# EasyEDA schematic ShutterController.json
TITLE: Shutter Controller; REV: 1.0; Date: 2021-11-27; Sheet: 1/1; Drawn By: M.P.M.; Company: MaPeMa
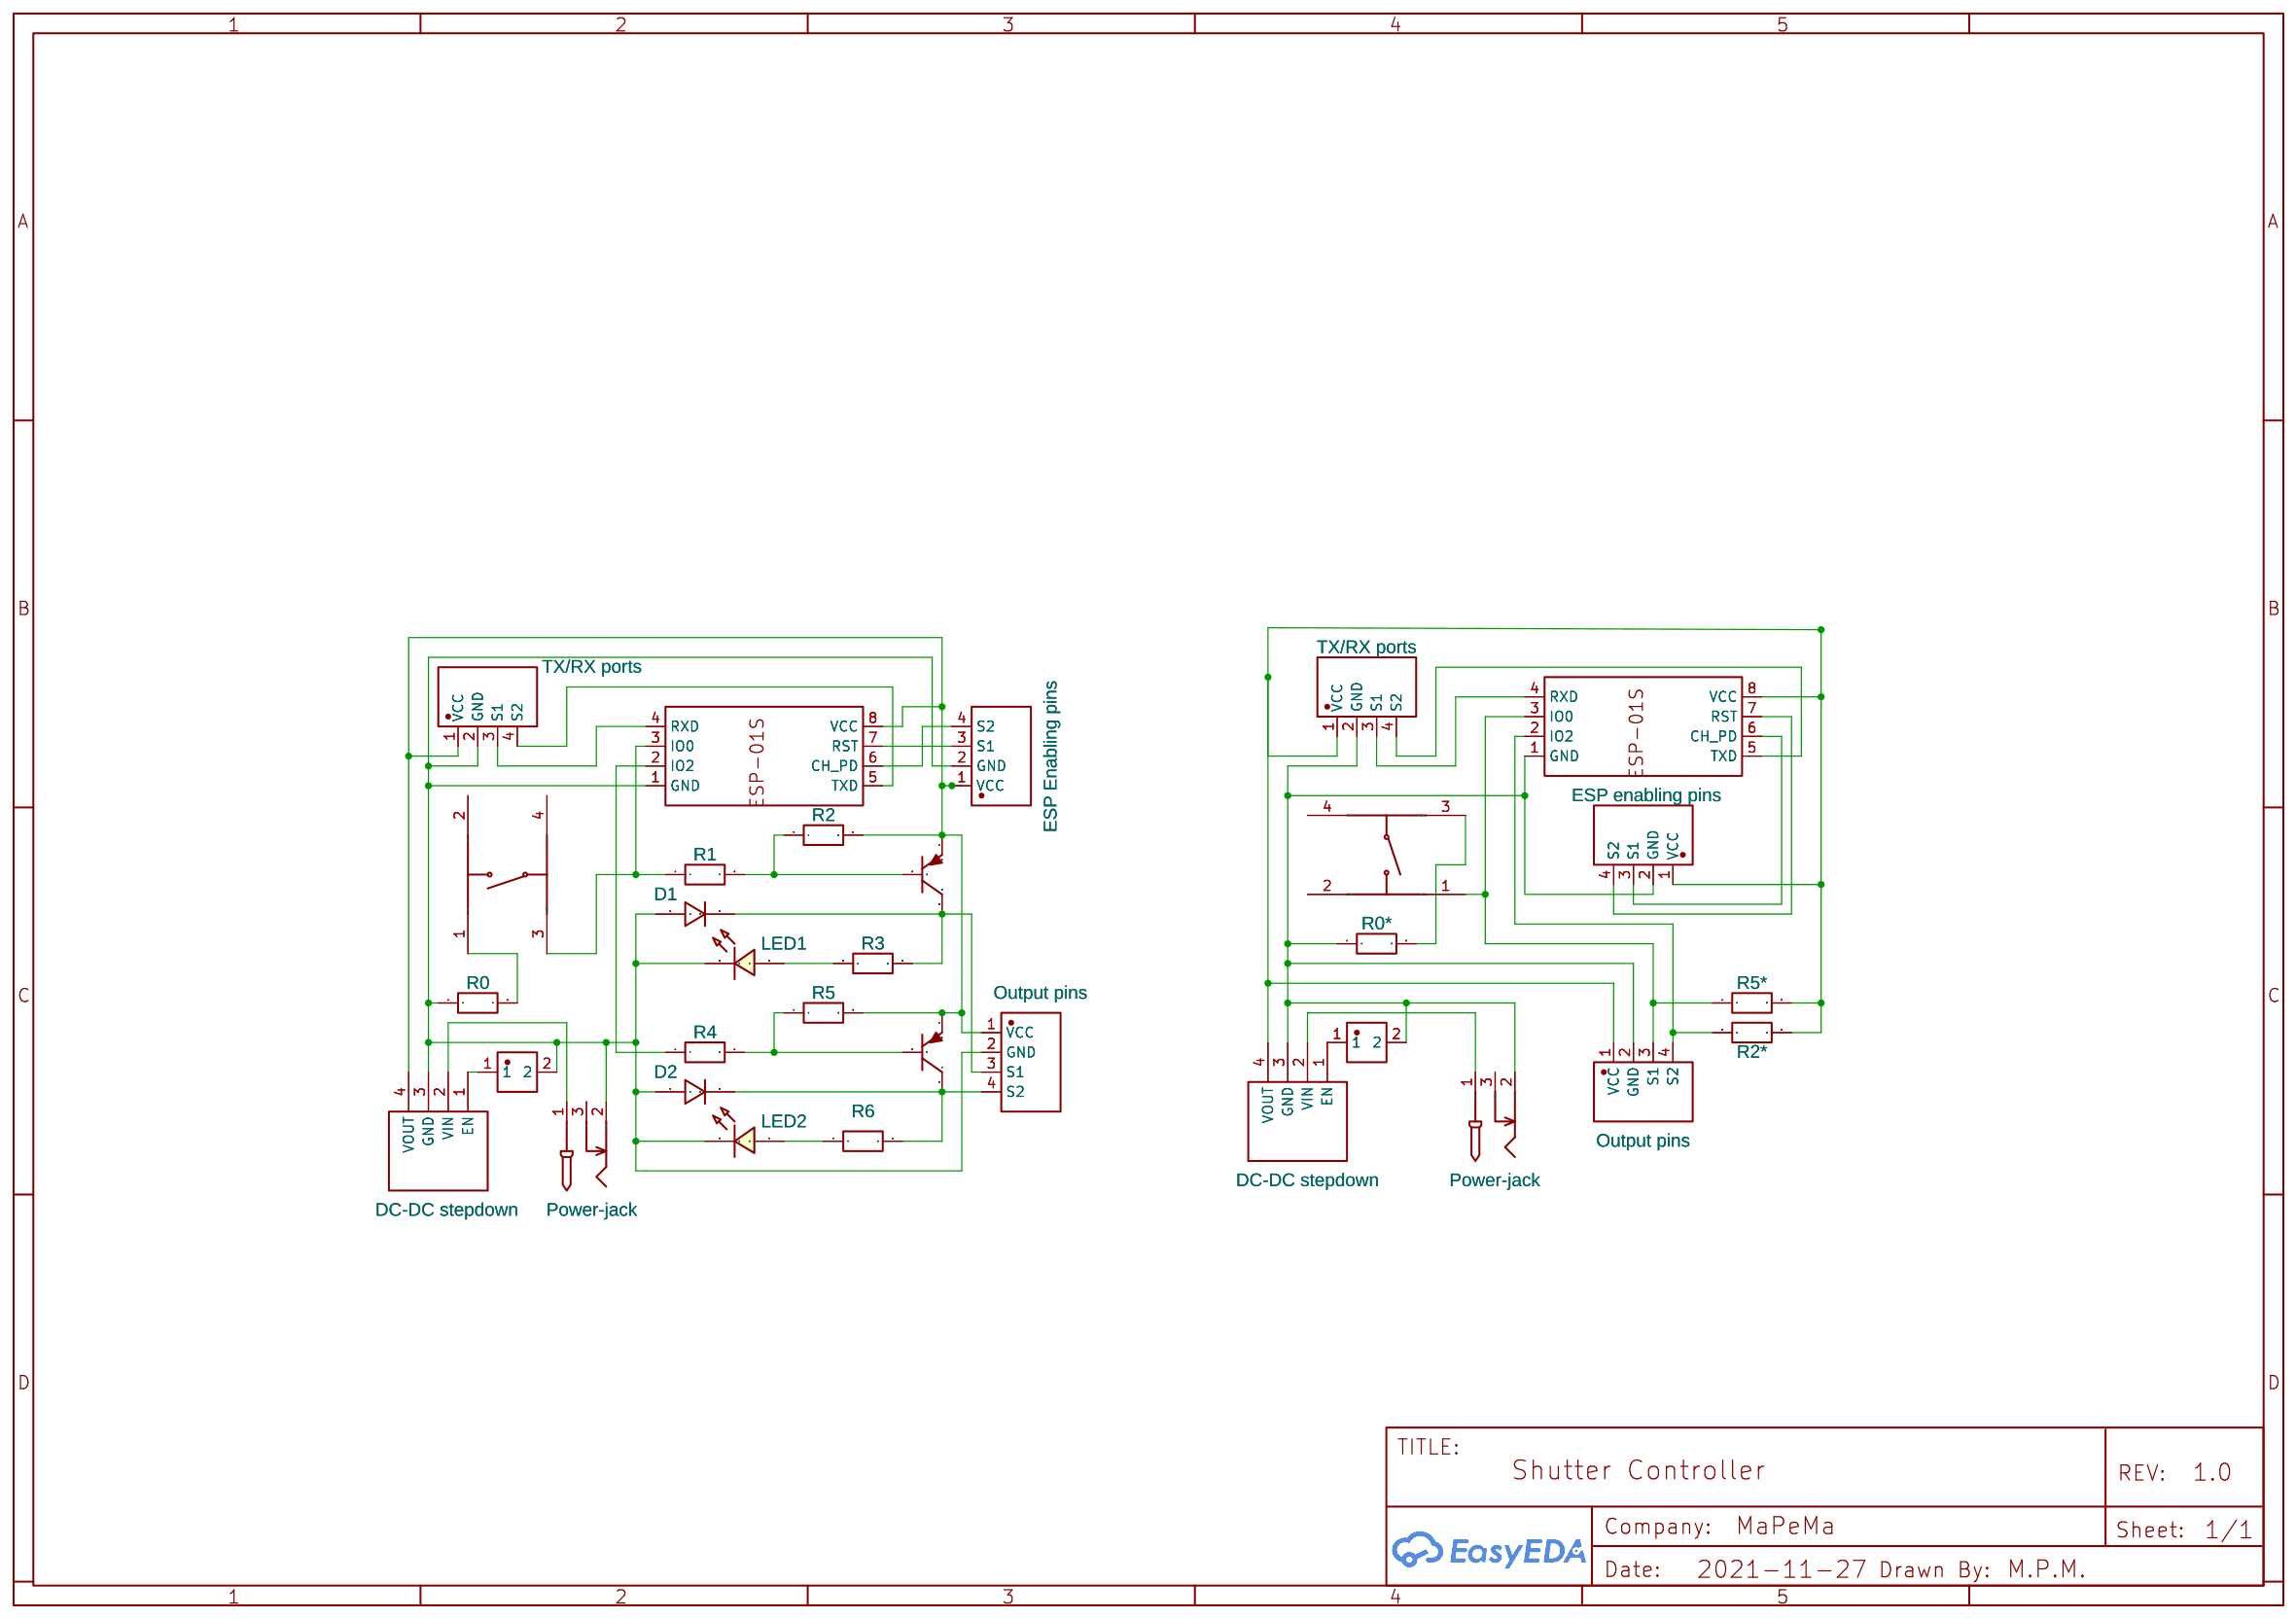
[diagram p0: schematic sheet]

## Parts
D1  1N4007  [DO-41_BD2.4-L4.7-P8.70-D0.9-RD]
D2  1N4007  [DO-41_BD2.4-L4.7-P8.70-D0.9-RD]
LED1  LED-TH-3mm_R  [LED-TH_BD3.0_RED]
LED2  LED-TH-3mm_R  [LED-TH_BD3.0_RED]
P1  Power-jack  [DC005-2.5MM]
P2  Power-jack  [DC005-2.5MM]
Q1  Bipolar PNP-SIL 2.54mm  [BIPOLAR TRANSISTOR-SIL 2.54 MM]
Q3  Bipolar PNP-SIL 2.54mm  [BIPOLAR TRANSISTOR-SIL 2.54 MM]
R0  1k  [R_AXIAL-0.3]
R0*  1k  [R_AXIAL-0.3]
R1  1k  [R_AXIAL-0.3]
R2  10k  [R_AXIAL-0.3]
R2*  1k  [R_AXIAL-0.3]
R3  1k  [R_AXIAL-0.3]
R4  1k  [R_AXIAL-0.3]
R5  10k  [R_AXIAL-0.3]
R5*  1k  [R_AXIAL-0.3]
R6  1k  [R_AXIAL-0.3]
SW1  Tactile_Switch_12*12*7.3 4 3 2 1  [TACTS-24N-F_12*12*7.3]
SW2  Tactile_Switch_12*12*7.3 4 3 2 1  [TACTS-24N-F_12*12*7.3]
U1  DC-DC stepdown  [STDN-3A24-ADJ]
U2  ESP-01S  [ESP-01S]
U3  TX/RX ports  [SIMPLE 4PIN CONNECTOR]
U4  Output pins  [SIMPLE 4PIN CONNECTOR]
U5  TX/RX ports  [SIMPLE 4PIN CONNECTOR]
U6  Simple 2pin connector  [SIMPLE 2PIN CONNECTOR]
U7  ESP Enabling pins  [SIMPLE 4PIN CONNECTOR]
U8  DC-DC stepdown  [STDN-3A24-ADJ]
U9  ESP-01S  [ESP-01S]
U10  ESP enabling pins  [SIMPLE 4PIN CONNECTOR]
U11  Output pins  [SIMPLE 4PIN CONNECTOR]
U12  Simple 2pin connector  [SIMPLE 2PIN CONNECTOR]

## Library data of the parts
D1 D2 = 1N4007: Supplier: LCSC; Manufacturer: SEMTECH; Supplier Part: C106903; Contributor: LCEDA_Lib
LED1 LED2 = LED-TH-3mm_R: Manufacturer: EVERLIGHT(台湾亿光); Manufacturer Part: 204-10SDRD/S530-A3-L; Supplier Part: C84774; Supplier: LCSC; Contributor: LCEDA_Lib
P1 P2 = DC005-2.5MM: Supplier: EasyEDA; Manufacturer: EasyEDA; Contributor: paia
Q1 Q3 = Bipolar PNP-SIL 2.54mm: Contributor: MLMontesinos
R0 R0* R1 R2 R2* R3-R5 R5* R6 = R_AXIAL-0.3_EU: Contributor: LCEDA_Lib
SW1 SW2 = Tactile_Switch_12*12*7.3 4 3 2 1: Manufacturer: NINIGI // OMRON; Manufacturer Part: TACTS-24N-F / TACTS-24K-F // B3F-40xx / B3F-50xx; link: https://omronfs.omron.com/en_US/ecb/products/pdf/en-b3f.pdf; Contributor: Oribu; Convert to PCB: Yes; Add into BOM: Yes
U1 U8 = STDN-3A24-ADJ: Manufacturer Part: HW-613; Supplier: HESTORE.HU; Supplier Part: 100.387.25; link: https://www.hestore.hu/prod_10038725.html; Contributor: dvoros
U2 U9 = ESP-01S: Supplier Part: C111009; Supplier: LCSC; Manufacturer: Ai-Thinker; Contributor: Deep Sohelia
U3-U5 U7 U10 U11 = Simple 4pin connector: Contributor: M.P.M.
U6 U12 = Simple 2pin connector: Contributor: M.P.M.

## Nets
Net-(D1-1): D1.1 Q1.3(C) R3.2 U4.3(S1)
Net-(D1-2): D1.2 D2.2 LED1.2 LED2.2 P1.2 R0.1 U1.3(GND) U2.1(GND) U3.2(GND) U4.2(GND) U6.2 U7.2(GND)
Net-(D2-1): D2.1 Q3.3(C) R6.2 U4.4(S2)
Net-(LED1-1): LED1.1 R3.1
Net-(LED2-1): LED2.1 R6.1
Net-(P1-1): P1.1 U1.2(VIN)
Net-(P2-1): P2.1 U8.2(VIN)
Net-(P2-2): P2.2 R0*.1 U5.2(GND) U8.3(GND) U9.1(GND) U10.2(GND) U11.2(GND) U12.2
Net-(Q1-1): Q1.1(E) Q3.1(E) R2.2 R5.2 U1.4(VOUT) U2.8(VCC) U3.1(VCC) U4.1(VCC) U7.1(VCC)
Net-(Q1-2): Q1.2(B) R1.2 R2.1
Net-(Q3-2): Q3.2(B) R4.2 R5.1
Net-(R0*-2): R0*.2 SW1.3(B)
Net-(R0-2): R0.2 SW2.1(D)
Net-(R1-1): R1.1 SW2.3(B) U2.3(IO0)
Net-(R2*-1): R2*.1 SW1.1(D) U9.3(IO0) U11.3(S1)
Net-(R2*-2): R2*.2 R5*.2 U5.1(VCC) U8.4(VOUT) U9.8(VCC) U10.1(VCC) U11.1(VCC)
Net-(R4-1): R4.1 U2.2(IO2)
Net-(R5*-1): R5*.1 U9.2(IO2) U11.4(S2)
Net-(U1-1): U1.1(EN) U6.1
Net-(U2-4): U2.4(RXD) U3.3(S1)
Net-(U2-5): U2.5(TXD) U3.4(S2)
Net-(U2-6): U2.6(CH_PD) U7.4(S2)
Net-(U2-7): U2.7(RST) U7.3(S1)
Net-(U5-3): U5.3(S1) U9.4(RXD)
Net-(U5-4): U5.4(S2) U9.5(TXD)
Net-(U8-1): U8.1(EN) U12.1
Net-(U9-6): U9.6(CH_PD) U10.3(S1)
Net-(U9-7): U9.7(RST) U10.4(S2)

Not connected (* = marked no-connect by the designer): P1 3; P2 3; SW1 2(C) 4(A); SW2 2(C) 4(A)
